# Altium schematic sheet ESP32 with USBC.SchDoc
size A2; SheetNumber: 1; SheetTotal: 1
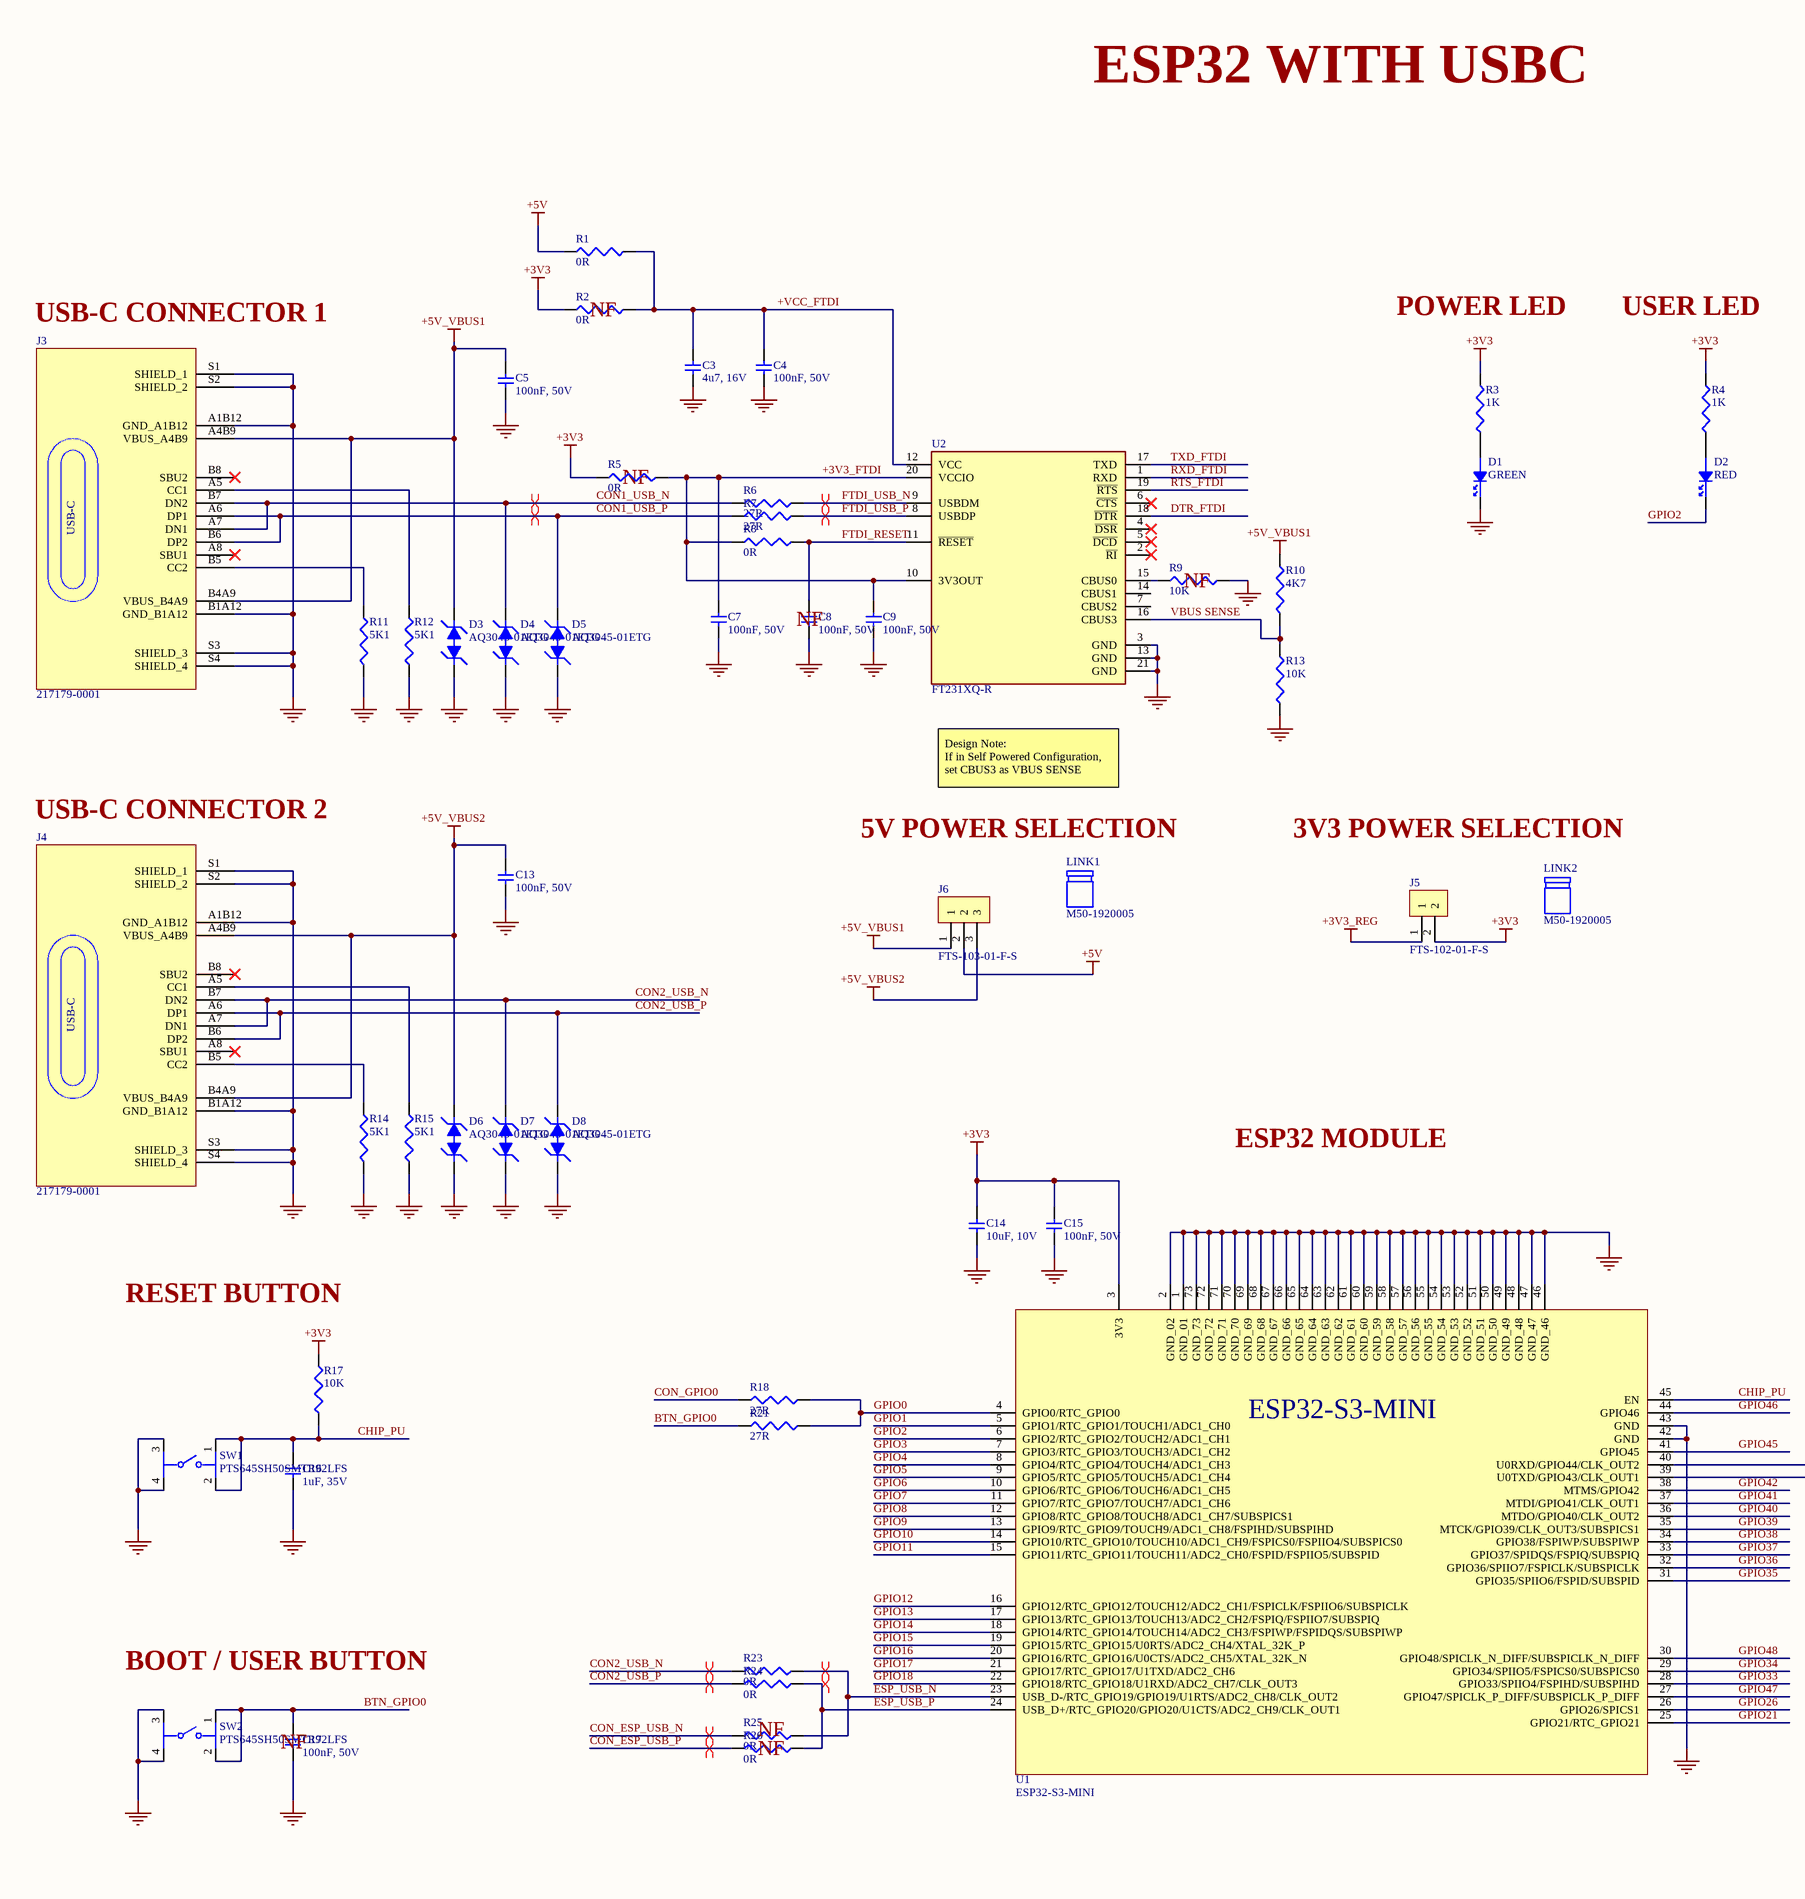
[diagram p0: ESP32 with USBC.SchDoc, left]
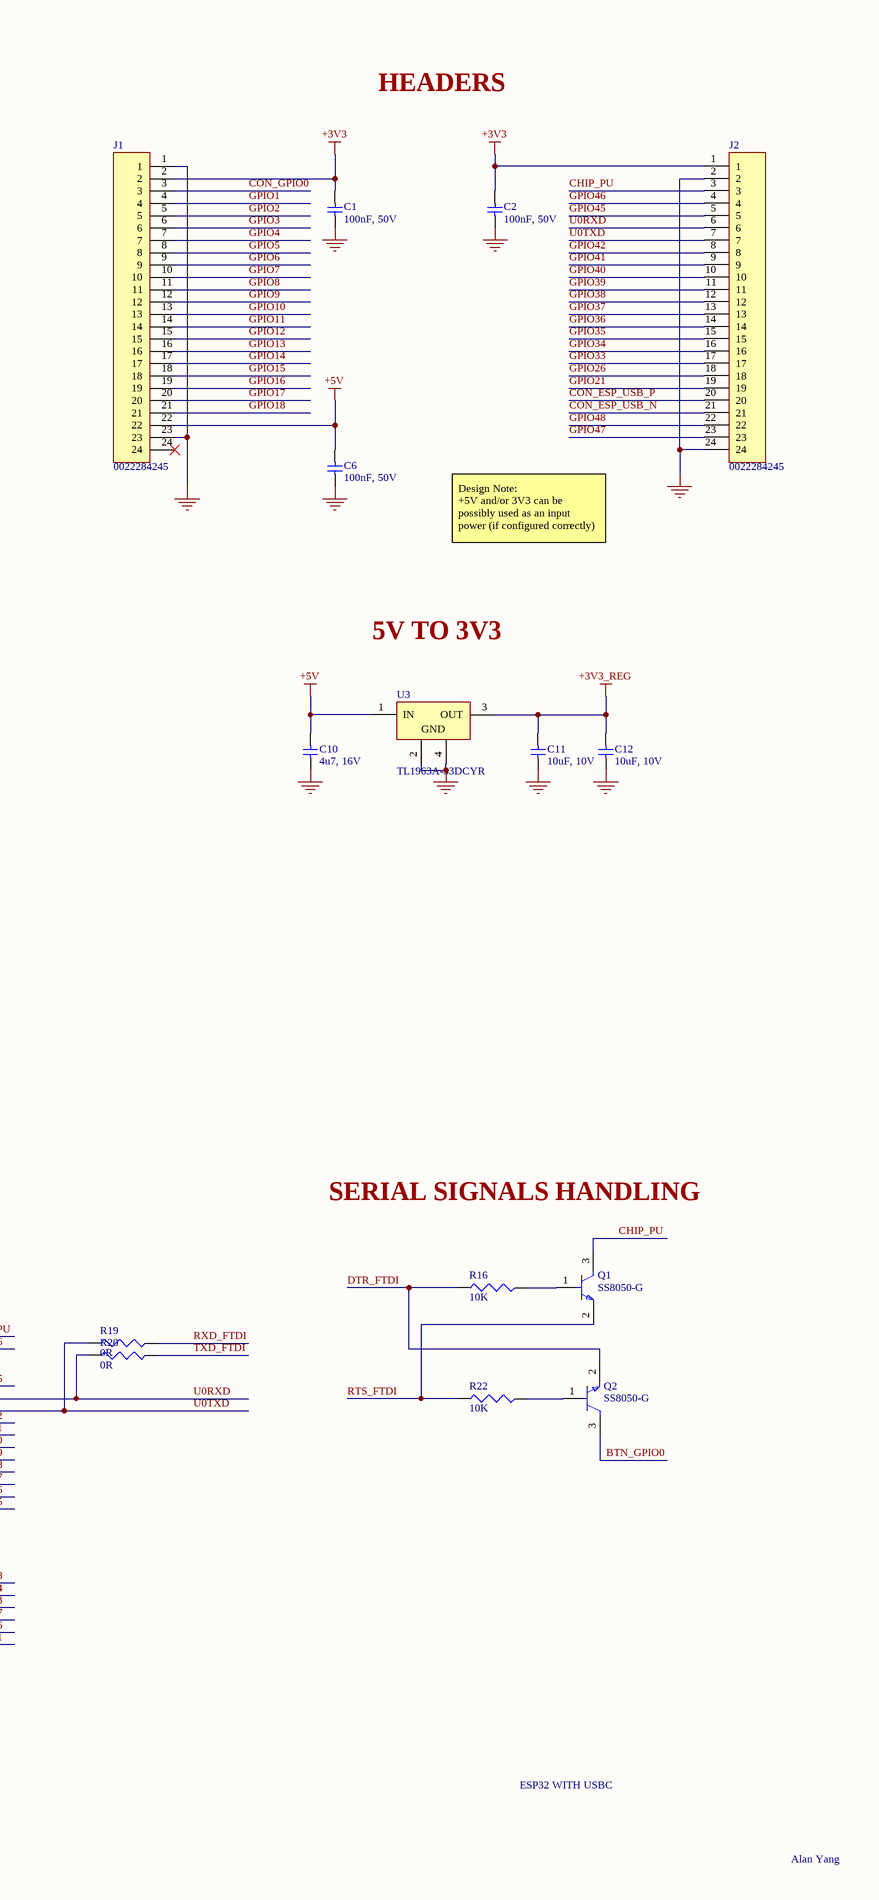
[diagram p1: ESP32 with USBC.SchDoc, right]

## Parts
C1  100nF, 50V  [CAPC1005X55N]
C2  100nF, 50V  [CAPC1005X55N]
C3  4u7, 16V  [CAPC1005X55N]
C4  100nF, 50V  [CAPC1005X55N]
C5  100nF, 50V  [CAPC1005X55N]
C6  100nF, 50V  [CAPC1005X55N]
C7  100nF, 50V  [CAPC1005X55N]
C8  100nF, 50V  [CAPC1005X55N]
C9  100nF, 50V  [CAPC1005X55N]
C10  4u7, 16V  [CAPC1005X55N]
C11  10uF, 10V  [CAPC1005X55N]
C12  10uF, 10V  [CAPC1005X55N]
C13  100nF, 50V  [CAPC1005X55N]
C14  10uF, 10V  [CAPC1005X55N]
C15  100nF, 50V  [CAPC1005X55N]
C16  1uF, 35V  [CAPC1005X55N]
C17  100nF, 50V  [CAPC1005X55N]
D1  GREEN  [LED0402G]
D2  RED  [LED0402R]
D3  AQ3045-01ETG  [SOD882]
D4  AQ3045-01ETG  [SOD882]
D5  AQ3045-01ETG  [SOD882]
D6  AQ3045-01ETG  [SOD882]
D7  AQ3045-01ETG  [SOD882]
D8  AQ3045-01ETG  [SOD882]
J1  0022284245  [HDR_1X24_2.54MM]
J2  0022284245  [HDR_1X24_2.54MM]
J3  217179-0001  [FP-2171790001-MFG]
J4  217179-0001  [FP-2171790001-MFG]
J5  FTS-102-01-F-S  [HDR_1X2_1.27MM]
J6  FTS-103-01-F-S  [HDR_1X3_1.27MM]
LINK1  M50-1920005  (mechanical)
LINK2  M50-1920005  (mechanical)
Q1  SS8050-G  [FP-SS8050-G-IPC_B]
Q2  SS8050-G  [FP-SS8050-G-IPC_B]
R1  0R  [RESC1005X37N]
R2  0R  [RESC1005X37N]
R3  1K  [RESC1005X37N]
R4  1K  [RESC1005X37N]
R5  0R  [RESC1005X37N]
R6  27R  [RESC1005X37N]
R7  27R  [RESC1005X37N]
R8  0R  [RESC1005X37N]
R9  10K  [RESC1005X37N]
R10  4K7  [RESC1005X37N]
R11  5K1  [RESC1005X37N]
R12  5K1  [RESC1005X37N]
R13  10K  [RESC1005X37N]
R14  5K1  [RESC1005X37N]
R15  5K1  [RESC1005X37N]
R16  10K  [RESC1005X37N]
R17  10K  [RESC1005X37N]
R18  27R  [RESC1005X37N]
R19  0R  [RESC1005X37N]
R20  0R  [RESC1005X37N]
R21  27R  [RESC1005X37N]
R22  10K  [RESC1005X37N]
R23  0R  [RESC1005X37N]
R24  0R  [RESC1005X37N]
R25  0R  [RESC1005X37N]
R26  0R  [RESC1005X37N]
SW1  PTS645SH50SMTR92LFS  [FP-PTS645SH50SMTR92LFS-MFG]
SW2  PTS645SH50SMTR92LFS  [FP-PTS645SH50SMTR92LFS-MFG]
U1  ESP32-S3-MINI  [XCVR_ESP32-S3-MINI-1-N8]
U2  FT231XQ-R  [FP-QFN-20-IPC_B]
U3  TL1963A-33DCYR  [DCY0004A_N]

## Nets
+3V3: C1.2 C2.2 C14.2 C15.2 J1.2 J2.1 J5.2 R2.1 R3.2 R4.2 R5.1 R17.2 U1.3(3V3)
+3V3_REG: C11.2 C12.2 J5.1 U3.3(OUT)
+5V: C6.2 C10.2 J1.22 J6.2 R1.1 U3.1(IN)
+5V_VBUS1: C5.2 D3.2 J3.A4B9(VBUS_A4B9) J3.B4A9(VBUS_B4A9) J6.1 R10.2
+5V_VBUS2: C13.2 D6.2 J4.A4B9(VBUS_A4B9) J4.B4A9(VBUS_B4A9) J6.3
GND: C1.1 C2.1 C3.2 C4.1 C5.1 C6.1 C7.1 C8.1 C9.1 C10.1 C11.1 C12.1 C13.1 C14.1 C15.1 C16.1 C17.1 D1.1 D3.1 D4.1 D5.1 D6.1 D7.1 D8.1 J1.1 J1.23 J2.2 J2.24 J3.A1B12(GND_A1B12) J3.B1A12(GND_B1A12) J3.S1(SHIELD_1) J3.S2(SHIELD_2) J3.S3(SHIELD_3) J3.S4(SHIELD_4) J4.A1B12(GND_A1B12) J4.B1A12(GND_B1A12) J4.S1(SHIELD_1) J4.S2(SHIELD_2) J4.S3(SHIELD_3) J4.S4(SHIELD_4) R9.2 R11.1 R12.1 R13.1 R14.1 R15.1 SW1.3 SW1.4 SW2.3 SW2.4 U1.1(GND_01) U1.2(GND_02) U1.42(GND) U1.43(GND) U1.46(GND_46) U1.47(GND_47) U1.48(GND_48) U1.49(GND_49) U1.50(GND_50) U1.51(GND_51) U1.52(GND_52) U1.53(GND_53) U1.54(GND_54) U1.55(GND_55) U1.56(GND_56) U1.57(GND_57) U1.58(GND_58) U1.59(GND_59) U1.60(GND_60) U1.61(GND_61) U1.62(GND_62) U1.63(GND_63) U1.64(GND_64) U1.65(GND_65) U1.66(GND_66) U1.67(GND_67) U1.68(GND_68) U1.69(GND_69) U1.70(GND_70) U1.71(GND_71) U1.72(GND_72) U1.73(GND_73) U2.3(GND) U2.13(GND) U2.21(GND) U3.2(GND) U3.4(GND)
+3V3_FTDI: C7.2 C9.2 R5.2 R8.1 U2.10(3V3OUT) U2.20(VCCIO)
+VCC_FTDI: C3.1 C4.2 R1.2 R2.2 U2.12(VCC)
BTN_GPIO0: C17.2 Q2.3(C) R21.1 SW2.1 SW2.2
CHIP_PU: C16.2 J2.3 Q1.3(C) R17.1 SW1.1 SW1.2 U1.45(EN)
CON1_USB_N: D4.2 J3.A7(DN1) J3.B7(DN2) R6.1
CON1_USB_P: D5.2 J3.A6(DP1) J3.B6(DP2) R7.1
CON2_USB_N: D7.2 J4.A7(DN1) J4.B7(DN2) R23.1
CON2_USB_P: D8.2 J4.A6(DP1) J4.B6(DP2) R24.1
CON_ESP_USB_N: J2.21 R25.1
CON_ESP_USB_P: J2.20 R26.1
CON_GPIO0: J1.3 R18.1
DTR_FTDI: Q2.2(E) R16.1 U2.18(~{DTR})
ESP_USB_N: R23.2 R25.2 U1.23(USB_D-/RTC_GPIO19/GPIO19/U1RTS/ADC2_CH8/CLK_OUT2)
ESP_USB_P: R24.2 R26.2 U1.24(USB_D+/RTC_GPIO20/GPIO20/U1CTS/ADC2_CH9/CLK_OUT1)
FTDI_RESET: C8.2 R8.2 U2.11(~{RESET})
FTDI_USB_N: R6.2 U2.9(USBDM)
FTDI_USB_P: R7.2 U2.8(USBDP)
GPIO0: R18.2 R21.2 U1.4(GPIO0/RTC_GPIO0)
GPIO1: J1.4 U1.5(GPIO1/RTC_GPIO1/TOUCH1/ADC1_CH0)
GPIO2: D2.1 J1.5 U1.6(GPIO2/RTC_GPIO2/TOUCH2/ADC1_CH1)
GPIO3: J1.6 U1.7(GPIO3/RTC_GPIO3/TOUCH3/ADC1_CH2)
GPIO4: J1.7 U1.8(GPIO4/RTC_GPIO4/TOUCH4/ADC1_CH3)
GPIO5: J1.8 U1.9(GPIO5/RTC_GPIO5/TOUCH5/ADC1_CH4)
GPIO6: J1.9 U1.10(GPIO6/RTC_GPIO6/TOUCH6/ADC1_CH5)
GPIO7: J1.10 U1.11(GPIO7/RTC_GPIO7/TOUCH7/ADC1_CH6)
GPIO8: J1.11 U1.12(GPIO8/RTC_GPIO8/TOUCH8/ADC1_CH7/SUBSPICS1)
GPIO9: J1.12 U1.13(GPIO9/RTC_GPIO9/TOUCH9/ADC1_CH8/FSPIHD/SUBSPIHD)
GPIO10: J1.13 U1.14(GPIO10/RTC_GPIO10/TOUCH10/ADC1_CH9/FSPICS0/FSPIIO4/SUBSPICS0)
GPIO11: J1.14 U1.15(GPIO11/RTC_GPIO11/TOUCH11/ADC2_CH0/FSPID/FSPIIO5/SUBSPID)
GPIO12: J1.15 U1.16(GPIO12/RTC_GPIO12/TOUCH12/ADC2_CH1/FSPICLK/FSPIIO6/SUBSPICLK)
GPIO13: J1.16 U1.17(GPIO13/RTC_GPIO13/TOUCH13/ADC2_CH2/FSPIQ/FSPIIO7/SUBSPIQ)
GPIO14: J1.17 U1.18(GPIO14/RTC_GPIO14/TOUCH14/ADC2_CH3/FSPIWP/FSPIDQS/SUBSPIWP)
GPIO15: J1.18 U1.19(GPIO15/RTC_GPIO15/U0RTS/ADC2_CH4/XTAL_32K_P)
GPIO16: J1.19 U1.20(GPIO16/RTC_GPIO16/U0CTS/ADC2_CH5/XTAL_32K_N)
GPIO17: J1.20 U1.21(GPIO17/RTC_GPIO17/U1TXD/ADC2_CH6)
GPIO18: J1.21 U1.22(GPIO18/RTC_GPIO18/U1RXD/ADC2_CH7/CLK_OUT3)
GPIO21: J2.19 U1.25(GPIO21/RTC_GPIO21)
GPIO26: J2.18 U1.26(GPIO26/SPICS1)
GPIO33: J2.17 U1.28(GPIO33/SPIIO4/FSPIHD/SUBSPIHD)
GPIO34: J2.16 U1.29(GPIO34/SPIIO5/FSPICS0/SUBSPICS0)
GPIO35: J2.15 U1.31(GPIO35/SPIIO6/FSPID/SUBSPID)
GPIO36: J2.14 U1.32(GPIO36/SPIIO7/FSPICLK/SUBSPICLK)
GPIO37: J2.13 U1.33(GPIO37/SPIDQS/FSPIQ/SUBSPIQ)
GPIO38: J2.12 U1.34(GPIO38/FSPIWP/SUBSPIWP)
GPIO39: J2.11 U1.35(MTCK/GPIO39/CLK_OUT3/SUBSPICS1)
GPIO40: J2.10 U1.36(MTDO/GPIO40/CLK_OUT2)
GPIO41: J2.9 U1.37(MTDI/GPIO41/CLK_OUT1)
GPIO42: J2.8 U1.38(MTMS/GPIO42)
GPIO45: J2.5 U1.41(GPIO45)
GPIO46: J2.4 U1.44(GPIO46)
GPIO47: J2.23 U1.27(GPIO47/SPICLK_P_DIFF/SUBSPICLK_P_DIFF)
GPIO48: J2.22 U1.30(GPIO48/SPICLK_N_DIFF/SUBSPICLK_N_DIFF)
RTS_FTDI: Q1.2(E) R22.1 U2.19(~{RTS})
RXD_FTDI: R19.2 U2.1(RXD)
TXD_FTDI: R20.2 U2.17(TXD)
U0RXD: J2.6 R20.1 U1.40(U0RXD/GPIO44/CLK_OUT2)
U0TXD: J2.7 R19.1 U1.39(U0TXD/GPIO43/CLK_OUT1)
VBUS SENSE: R10.1 R13.2 U2.16(CBUS3)
NetD1_2: D1.2 R3.1
NetD2_2: D2.2 R4.1
NetJ3_A5: J3.A5(CC1) R12.2
NetJ3_B5: J3.B5(CC2) R11.2
NetJ4_A5: J4.A5(CC1) R15.2
NetJ4_B5: J4.B5(CC2) R14.2
NetQ1_1: Q1.1(B) R16.2
NetQ2_1: Q2.1(B) R22.2
NetR9_1: R9.1 U2.15(CBUS0)

Not connected (* = marked no-connect by the designer): J1 24*; J3 A8(SBU1)* B8(SBU2)*; J4 A8(SBU1)* B8(SBU2)*; U2 2(~{RI})* 4(~{DSR})* 5(~{DCD})* 6(~{CTS})* 7(CBUS2) 14(CBUS1)

## Layout directives
differential pair; differential pair class DIFF90: CON1_USB_N, CON1_USB_P, CON2_USB_N, CON2_USB_P, CON_ESP_USB_N, CON_ESP_USB_P, ESP_USB_N, ESP_USB_P, FTDI_USB_N, FTDI_USB_P

## Notes on the sheet
- ESP32 WITH USBC
- HEADERS
- (near J3) USB-C CONNECTOR 1
- (near R2) NF
- POWER LED
- USER LED
- (near R5) NF
- (near R9) NF
- Design Note:
  +5V and/or 3V3 can be possibly used as an input power (if configured correctly)
- (near C8) NF
- 5V TO 3V3
- Design Note:
  If in Self Powered Configuration, set CBUS3 as VBUS SENSE
- (near J4) USB-C CONNECTOR 2
- (near LINK1) 5V POWER SELECTION
- (near LINK2) 3V3 POWER SELECTION
- ESP32 MODULE
- RESET BUTTON
- SERIAL SIGNALS HANDLING
- BOOT / USER BUTTON
- (near C17) NF
- (near R25) NF
- NF
- Alan Yang
- (in symbol 217179-0001) USB-C

## Library data of the parts
C1 C2 C4-C9 C13 C15 C17 = CL05B104KB54PNC: CAP CER 0.1UF 50V X7R 0402; Manufacturer: Samsung; Dielectric Material: Ceramic; Supplier: Avnet; Supplier Part Number: CL05B104KB54PNC; Manufacturer Part Number: CL05B104KB54PNC; RoHS: Yes; Category: Ceramic Capacitors; Pricing: 10000=0.00647, 20000=0.00644, 40000=0.0064, 60000=0.00637, 80000=0.00634 (USD); Pins: 2; Capacitor Type: Ceramic; RoHS Compliant: Yes; Reach SVHC Compliant: Yes; ComponentLink1URL: https://datasheet.ciiva.com:443/pdfs/VipMasterIC/IC/SEMS/SEMS-S-A0006318249/SEMS-S-A0006320959-1.pdf?src-supplier=IHS+Markit; ComponentLink1Description: https://datasheet.ciiva.com:443/pdfs/VipMasterIC/IC/SEMS/SEMS-S-A0006318249/SEMS-S-A0006320959-1.pdf?src-supplier=IHS+Markit; ComponentLink2URL: https://datasheet.octopart.com/CL05B104KB54PNC-Samsung-datasheet-8326407.pdf?src-supplier=TME; ComponentLink2Description: https://datasheet.octopart.com/CL05B104KB54PNC-Samsung-datasheet-8326407.pdf?src-supplier=TME; LCSC Part Number: C307331
C3 C10 = CL05A475MO5NUNC: CAP CER 4.7UF 16V X5R 0402; Manufacturer: Samsung; Dielectric Material: Ceramic; Multilayer: Yes; Tolerance  (fill in as +-): 20%; Supplier: Digikey; Supplier Part Number: 1276-6836-1-ND; Manufacturer Part Number: CL05A475MO5NUNC; RoHS: Yes; Category: Ceramic Capacitors; Stock: 185202; Pricing: 1=0.2, 10=0.126, 100=0.0864, 1000=0.06956 (USD); Mounting Technology: Surface Mount; Pins: 2; Package Shape: Rectangular; Case/Package: 0402; Terminal Finish: Nickel; Min Operating Temperature: -55°C; Max Operating Temperature: 85°C; JESD-609 Code: e3; Value: 4.7uF; Capacitor Type: Ceramic; Package Style: SMTMeter; Packaging: Tape and Reel; Tolerance (fill in as +-): 20%; Rated DC Voltage (URdc): 16V; Temperature Characteristics Code: X5R; Termination: Wraparound; Length: 1mm; Width: 0.5mm; Height: 0.7mm; Reach SVHC Compliant: Yes; RoHS Compliant: Yes; ComponentLink1URL: https://datasheet.ciiva.com:443/pdfs/VipMasterIC/IC/SEMS/SEMS-S-A0008384515/SEMS-S-A0008898881-1.pdf?src-supplier=IHS+Markit; ComponentLink1Description: https://datasheet.ciiva.com:443/pdfs/VipMasterIC/IC/SEMS/SEMS-S-A0008384515/SEMS-S-A0008898881-1.pdf?src-supplier=IHS+Markit; ComponentLink2URL: http://www.farnell.com/datasheets/2710653.pdf?src-supplier=Farnell; ComponentLink2Description: http://www.farnell.com/datasheets/2710653.pdf?src-supplier=Farnell; ComponentLink3URL: http://www.samsungsem.com/kr/support/product-search/mlcc/CL05A475MO5NUNC.jsp?src-supplier=Digikey; ComponentLink3Description: http://www.samsungsem.com/kr/support/product-search/mlcc/CL05A475MO5NUNC.jsp?src-supplier=Digikey; ComponentLink4URL: http://www.farnell.com/datasheets/2710653.pdf?src-supplier=Newark; ComponentLink4Description: http://www.farnell.com/datasheets/2710653.pdf?src-supplier=Newark; ComponentLink5URL: http://www.farnell.com/datasheets/2710653.pdf?src-supplier=Element14; ComponentLink5Description: http://www.farnell.com/datasheets/2710653.pdf?src-supplier=Element14; ComponentLink6URL: https://datasheet.octopart.com/CL05A475MO5NUNC-Samsung-Electro-Mechanics-datasheet-123102911.pdf?src-supplier=Future+Electronics; ComponentLink6Description: https://datasheet.octopart.com/CL05A475MO5NUNC-Samsung-Electro-Mechanics-datasheet-123102911.pdf?src-supplier=Future+Electronics; LCSC Part Number: C318563
C11 C12 C14 = CL05A106MP8NUB8: CAP CER 10UF 10V X5R 0402; Manufacturer: Samsung; Dielectric Material: Ceramic; Multilayer: Yes; Tolerance  (fill in as +-): 20%; Supplier: Digikey; Supplier Part Number: 1276-6830-1-ND; Manufacturer Part Number: CL05A106MP8NUB8; RoHS: Yes; Category: Ceramic Capacitors; Stock: 145429; Pricing: 1=0.2, 10=0.12, 100=0.0808, 1000=0.0568 (USD); Mounting Technology: Surface Mount; Pins: 2; Package Shape: Rectangular; Case/Package: 0402; Terminal Finish: Nickel; Min Operating Temperature: -55°C; Max Operating Temperature: 85°C; JESD-609 Code: e3; Value: 10uF; Capacitor Type: Ceramic; Packaging: Tape and Reel; Tolerance (fill in as +-): 20%; Rated DC Voltage (URdc): 10V; Temperature Characteristics Code: X5R; Termination: Wraparound; Reach SVHC Compliant: Yes; RoHS Compliant: Yes; ComponentLink1URL: https://datasheet.ciiva.com:443/pdfs/VipMasterIC/IC/SEMS/SEMS-S-A0008521219/SEMS-S-A0008521325-1.pdf?src-supplier=IHS+Markit; ComponentLink1Description: https://datasheet.ciiva.com:443/pdfs/VipMasterIC/IC/SEMS/SEMS-S-A0008521219/SEMS-S-A0008521325-1.pdf?src-supplier=IHS+Markit; ComponentLink2URL: http://www.samsungsem.com/kr/support/product-search/mlcc/CL05A106MP8NUB8.jsp?src-supplier=Digikey; ComponentLink2Description: http://www.samsungsem.com/kr/support/product-search/mlcc/CL05A106MP8NUB8.jsp?src-supplier=Digikey; ComponentLink3URL: https://datasheet.octopart.com/CL05A106MP8NUB8-Samsung-Electro-Mechanics-datasheet-136460857.pdf?src-supplier=Future+Electronics; ComponentLink3Description: https://datasheet.octopart.com/CL05A106MP8NUB8-Samsung-Electro-Mechanics-datasheet-136460857.pdf?src-supplier=Future+Electronics; LCSC Part Number: C307415
C16 = CL05A105KL5NRNC: CAP CER 1UF 35V X5R 0402; Manufacturer: Samsung; Dielectric Material: Ceramic; Multilayer: Yes; Tolerance  (fill in as +-): 10%; Supplier: Digikey; Supplier Part Number: 1276-6796-1-ND; Manufacturer Part Number: CL05A105KL5NRNC; RoHS: Yes; Category: Ceramic Capacitors; Stock: 168952; Pricing: 1=0.29, 10=0.17, 100=0.1097, 1000=0.07829, 2500=0.06853, 5000=0.06578 (USD); Mounting Technology: Surface Mount; Pins: 2; Package Shape: Rectangular; Case/Package: 0402; Terminal Finish: Nickel; Min Operating Temperature: -55°C; Max Operating Temperature: 85°C; JESD-609 Code: e3; Value: 1uF; Capacitor Type: Ceramic; Packaging: Tape and Reel; Tolerance (fill in as +-): 10%; Rated DC Voltage (URdc): 35V; Temperature Characteristics Code: X5R; Termination: Wraparound; Reach SVHC Compliant: Yes; RoHS Compliant: Yes; ComponentLink1URL: https://datasheet.ciiva.com:443/pdfs/VipMasterIC/IC/SEMS/SEMS-S-A0008384515/SEMS-S-A0008872905-1.pdf?src-supplier=IHS+Markit; ComponentLink1Description: https://datasheet.ciiva.com:443/pdfs/VipMasterIC/IC/SEMS/SEMS-S-A0008384515/SEMS-S-A0008872905-1.pdf?src-supplier=IHS+Markit; ComponentLink2URL: http://www.samsungsem.com/kr/support/product-search/mlcc/CL05A105KL5NRNC.jsp?src-supplier=Digikey; ComponentLink2Description: http://www.samsungsem.com/kr/support/product-search/mlcc/CL05A105KL5NRNC.jsp?src-supplier=Digikey; ComponentLink3URL: https://datasheet.octopart.com/CL05A105KL5NRNC-Samsung-datasheet-8326407.pdf?src-supplier=TME; ComponentLink3Description: https://datasheet.octopart.com/CL05A105KL5NRNC-Samsung-datasheet-8326407.pdf?src-supplier=TME; LCSC Part Number: C307413
D1 = VLMG1500-GS08: LED YLW-GRN 0402 SMD; Manufacturer: Vishay; Color: Green,Yellow; Shape: Rectangular; Forward Current: 30mA; Forward Voltage: 2.4V; Luminous Intensity-Nom: 90mcd; Channels: 1; Optoelectronic Device Type: SINGLE COLOR LED; Reverse Voltage-Max: 5V; Viewing Angle: 130°; Overall Height: 0.35mm; Supplier: Digikey; Supplier Part Number: VLMG1500-GS08CT-ND; Manufacturer Part Number: VLMG1500-GS08; RoHS: Yes; Category: LEDs; Stock: 119926; Pricing: 1=0.24, 10=0.164, 100=0.1147, 500=0.09218, 1000=0.0847 (USD); Mounting Technology: Surface Mount; Pins: 2; Color@wavelength: Green; Min Operating Temperature: -30°C; Max Operating Temperature: 85°C; Packaging: Tape and Reel; Size: 0.5mm; Terminal Pitch: 0.95mm; Reach SVHC Compliant: Yes; RoHS Compliant: Yes; ComponentLink1URL: https://datasheet.ciiva.com:443/pdfs/VipMasterIC/IC/VISH/VISH-S-A0003457490/VISH-S-A0003457490-1.pdf?src-supplier=IHS+Markit; ComponentLink1Description: https://datasheet.ciiva.com:443/pdfs/VipMasterIC/IC/VISH/VISH-S-A0003457490/VISH-S-A0003457490-1.pdf?src-supplier=IHS+Markit; ComponentLink2URL: https://datasheet.ciiva.com/12071/vlmo1500-244705-12071911.pdf?src-supplier=Mouser; ComponentLink2Description: https://datasheet.ciiva.com/12071/vlmo1500-244705-12071911.pdf?src-supplier=Mouser; ComponentLink3URL: https://datasheet.ciiva.com/13945/vlmo1500-13945360.pdf?src-supplier=Digikey; ComponentLink3Description: https://datasheet.ciiva.com/13945/vlmo1500-13945360.pdf?src-supplier=Digikey; ComponentLink4URL: https://datasheet.ciiva.com/30005/vlmo1500-30005134.pdf?src-supplier=Avnet; ComponentLink4Description: https://datasheet.ciiva.com/30005/vlmo1500-30005134.pdf?src-supplier=Avnet; ComponentLink5URL: https://datasheet.ciiva.com/13945/vlmo1500-13945358.pdf?src-supplier=Digikey; ComponentLink5Description: https://datasheet.ciiva.com/13945/vlmo1500-13945358.pdf?src-supplier=Digikey; ComponentLink6URL: https://datasheet.ciiva.com/13945/vlmo1500-13945359.pdf?src-supplier=Digikey; ComponentLink6Description: https://datasheet.ciiva.com/13945/vlmo1500-13945359.pdf?src-supplier=Digikey; LCSC Part Number: C511404
D2 = VLMS1500-GS08: LED RED 0402 SMD; Manufacturer: Vishay; Shape: Rectangular; Forward Current: 30mA; Forward Voltage: 2.4V; Luminous Intensity-Nom: 54mcd; Channels: 1; Optoelectronic Device Type: SINGLE COLOR LED; Reverse Voltage-Max: 5V; Viewing Angle: 130°; Overall Height: 0.35mm; Supplier: Digikey; Supplier Part Number: VLMS1500-GS08CT-ND; Manufacturer Part Number: VLMS1500-GS08; RoHS: Yes; Category: LEDs; Stock: 90755; Pricing: 1=0.24, 10=0.164, 100=0.1147, 500=0.09218, 1000=0.0847 (USD); Mounting Technology: Surface Mount; Pins: 2; Color: Red; Color@wavelength: Red; Min Operating Temperature: -30°C; Max Operating Temperature: 85°C; Packaging: Tape and Reel; Size: 0.5mm; Terminal Pitch: 0.95mm; Reach SVHC Compliant: Yes; RoHS Compliant: Yes; ComponentLink1URL: https://datasheet.ciiva.com:443/pdfs/VipMasterIC/IC/VISH/VISH-S-A0003457490/VISH-S-A0003457490-1.pdf?src-supplier=IHS+Markit; ComponentLink1Description: https://datasheet.ciiva.com:443/pdfs/VipMasterIC/IC/VISH/VISH-S-A0003457490/VISH-S-A0003457490-1.pdf?src-supplier=IHS+Markit; ComponentLink2URL: https://datasheet.ciiva.com/13945/vlmo1500-13945367.pdf?src-supplier=Digikey; ComponentLink2Description: https://datasheet.ciiva.com/13945/vlmo1500-13945367.pdf?src-supplier=Digikey; ComponentLink3URL: https://datasheet.ciiva.com/13945/vlmo1500-13945368.pdf?src-supplier=Digikey; ComponentLink3Description: https://datasheet.ciiva.com/13945/vlmo1500-13945368.pdf?src-supplier=Digikey; ComponentLink4URL: https://datasheet.ciiva.com/13945/vlmo1500-13945369.pdf?src-supplier=Digikey; ComponentLink4Description: https://datasheet.ciiva.com/13945/vlmo1500-13945369.pdf?src-supplier=Digikey; LCSC Part Number: C511370
D3-D8 = AQ3045-01ETG: TVS DIODE 5.3VWM 12VC SOD882; Manufacturer: Littelfuse; Diode Element Material: SILICON; Package Body Material: Plastic; Polarity: Bidirectional; Max Breakdown Voltage: 9V; Min Breakdown Voltage: 6.8V; Diode Type: TRANS VOLTAGE SUPPRESSOR; Non-rep Peak Rev Power Dis-Max: 40W; Number of Elements: 1; Rep Pk Reverse Voltage-Max: 5.3V; Reference Standard: AEC-Q101; Supplier: Digikey; Supplier Part Number: F9321CT-ND; Manufacturer Part Number: AQ3045-01ETG; RoHS: Yes; Category: TVS Diodes; Stock: 97; Pricing: 1=0.46, 10=0.302, 100=0.141, 500=0.134, 1000=0.127, 2000=0.1255, 5000=0.124 (USD); Pins: 2; Package Shape: Rectangular; Min Operating Temperature: -55°C; Max Operating Temperature: 150°C; Package Style: CHIP CARRIERMeter; Surface Mount: Yes; Technology: AVALANCHE; Terminal Form: No Lead; Terminal Position: BOTTOM; Reach SVHC Compliant: Yes; RoHS Compliant: Yes; ComponentLink1URL: https://datasheet.ciiva.com:443/pdfs/VipMasterIC/IC/LFSI/LFSI-S-A0007892042/LFSI-S-A0007892042-1.pdf?src-supplier=IHS+Markit; ComponentLink1Description: https://datasheet.ciiva.com:443/pdfs/VipMasterIC/IC/LFSI/LFSI-S-A0007892042/LFSI-S-A0007892042-1.pdf?src-supplier=IHS+Markit; ComponentLink2URL: http://www.littelfuse.com/~/media/electronics/datasheets/tvs_diode_arrays/littelfuse_tvs_diode_array_aq3045_datasheet.pdf.pdf?src-supplier=Digikey; ComponentLink2Description: http://www.littelfuse.com/~/media/electronics/datasheets/tvs_diode_arrays/littelfuse_tvs_diode_array_aq3045_datasheet.pdf.pdf?src-supplier=Digikey; ComponentLink3URL: https://www.littelfuse.com/~/media/electronics/datasheets/tvs_diode_arrays/littelfuse_tvs_diode_array_aq3045_datasheet.pdf.pdf?src-supplier=Digikey; ComponentLink3Description: https://www.littelfuse.com/~/media/electronics/datasheets/tvs_diode_arrays/littelfuse_tvs_diode_array_aq3045_datasheet.pdf.pdf?src-supplier=Digikey; ComponentLink4URL: https://datasheet.octopart.com/AQ3045-01ETG-Littelfuse-datasheet-101609968.pdf?src-supplier=Farnell; ComponentLink4Description: https://datasheet.octopart.com/AQ3045-01ETG-Littelfuse-datasheet-101609968.pdf?src-supplier=Farnell; ComponentLink5URL: https://datasheet.octopart.com/AQ3045-01ETG-Littelfuse-datasheet-140480283.pdf?src-supplier=Future+Electronics; ComponentLink5Description: https://datasheet.octopart.com/AQ3045-01ETG-Littelfuse-datasheet-140480283.pdf?src-supplier=Future+Electronics; LCSC Part Number: C3710326
J1 J2 = 0022284245: CONN HEADER VERT 24POS 2.54MM; Manufacturer: Molex; Supplier: Digikey; Supplier Part Number: 900-0022284245-ND; Manufacturer Part Number: 22-28-4245; RoHS: No; Category: Headers and Wire Housings; Stock: 2532; Pricing: 1=1.21, 10=1.024, 100=0.8699, 500=0.77638, 1000=0.73932, 5000=0.65998, 10000=0.62851 (USD); ComponentLink1URL: https://datasheet.ciiva.com/6814/022284363-sd-6814049.pdf?src-supplier=Digikey; ComponentLink1Description: https://datasheet.ciiva.com/6814/022284363-sd-6814049.pdf?src-supplier=Digikey; ComponentLink2URL: https://datasheet.ciiva.com/10075/0022284245-pcb-headers-10075617.pdf?src-supplier=Avnet; ComponentLink2Description: https://datasheet.ciiva.com/10075/0022284245-pcb-headers-10075617.pdf?src-supplier=Avnet; ComponentLink3URL: https://datasheet.ciiva.com/1433/1597854-1433759.pdf?src-supplier=Element14; ComponentLink3Description: https://datasheet.ciiva.com/1433/1597854-1433759.pdf?src-supplier=Element14; LCSC Part Number: C7145888
J3 J4 = 217179-0001: CONN RCP USB2.0 TYP C 24P SMD RA; Manufacturer: Molex; Supplier: Digikey; Supplier Part Number: 900-2171790001CT-ND; Manufacturer Part Number: 217179-0001; RoHS: No; Category: Connectors; Stock: 19217; Pricing: 1=0.83, 10=0.704, 25=0.6596, 50=0.628, 100=0.598, 250=0.56052, 500=0.53374 (USD); LCSC Part Number: C3197684
J5 = FTS-102-01-F-S: CONN HEADER VERT 2POS 1.27MM; Manufacturer: Samtec; Manufacturer Series: FTS; Connector Type: BOARD CONNECTOR; Option: General Purpose; Additional Feature: Low Profile; Filter Feature: No; Number of Rows Loaded: 1; Number of Contacts: 2; Supplier: Digikey; Supplier Part Number: SAM15176-ND; Manufacturer Part Number: FTS-102-01-F-S; RoHS: Yes; Category: Connectors; Stock: 520; Pricing: 1=0.49, 50=0.4252, 100=0.3608, 500=0.2994, 1000=0.25609, 2000=0.20954, 5000=0.19062 (USD); Mounting Technology: Board; Contact Material: Bronze; Contact Finish - Mating: GOLD (3) OVER NICKEL (50); Contact Finish - Termination: Matte Tin (Sn) - with Nickel (Ni) barrier; JESD-609 Code: e3; Contact Gender: Male; Mixed Contacts: No; Mounting Style: STRAIGHT; Termination: Solder; Terminal Pitch: 1.27mm; Flammability Rating: UL94 V-0; DIN Conformance: No; IEC Conformance: No; MIL Conformance: No; Reach SVHC Compliant: Yes; RoHS Compliant: Yes; ComponentLink1URL: https://datasheet.ciiva.com:443/pdfs/VipMasterIC/IC/SAMI/SAMI-S-A0001504673/SAMI-S-A0001504673-1.pdf?src-supplier=IHS+Markit; ComponentLink1Description: https://datasheet.ciiva.com:443/pdfs/VipMasterIC/IC/SAMI/SAMI-S-A0001504673/SAMI-S-A0001504673-1.pdf?src-supplier=IHS+Markit; ComponentLink2URL: http://suddendocs.samtec.com/catalog_english/fts.pdf?src-supplier=Digikey; ComponentLink2Description: http://suddendocs.samtec.com/catalog_english/fts.pdf?src-supplier=Digikey; ComponentLink3URL: http://www.samtec.com/documents/webfiles/pdf/FTS.pdf?src-supplier=Avnet; ComponentLink3Description: http://www.samtec.com/documents/webfiles/pdf/FTS.pdf?src-supplier=Avnet; ComponentLink4URL: https://datasheet.octopart.com/FTS-102-01-F-S-Samtec-datasheet-118493358.pdf?src-supplier=Electro+Sonic; ComponentLink4Description: https://datasheet.octopart.com/FTS-102-01-F-S-Samtec-datasheet-118493358.pdf?src-supplier=Electro+Sonic; ComponentLink5URL: https://datasheet.octopart.com/FTS-102-01-F-S-Samtec-datasheet-151470456.pdf?src-supplier=Sager+Electronics; ComponentLink5Description: https://datasheet.octopart.com/FTS-102-01-F-S-Samtec-datasheet-151470456.pdf?src-supplier=Sager+Electronics; ComponentLink6URL: https://datasheet.octopart.com/FTS-102-01-F-S-Samtec-datasheet-176663378.pdf?src-supplier=Toby+Electronics; ComponentLink6Description: https://datasheet.octopart.com/FTS-102-01-F-S-Samtec-datasheet-176663378.pdf?src-supplier=Toby+Electronics; LCSC Part Number: C6045317
J6 = FTS-103-01-F-S: CONN HEADER VERT 3POS 1.27MM; Manufacturer: Samtec; Manufacturer Series: FTS; Connector Type: BOARD CONNECTOR; Option: General Purpose; Additional Feature: Low Profile; Filter Feature: No; Number of Rows Loaded: 1; Number of Contacts: 3; Supplier: Digikey; Supplier Part Number: 612-FTS-103-01-F-S-ND; Manufacturer Part Number: FTS-103-01-F-S; RoHS: Yes; Category: Connectors; Stock: 1584; Pricing: 1=0.73, 50=0.6378, 100=0.5407, 500=0.4491, 1000=0.38362, 2000=0.31431, 5000=0.2478, 10000=0.228 (USD); Mounting Technology: Board; Contact Material: Bronze; Contact Finish - Mating: GOLD (3) OVER NICKEL (50); Contact Finish - Termination: Matte Tin (Sn) - with Nickel (Ni) barrier; JESD-609 Code: e3; Contact Gender: Male; Mixed Contacts: No; Mounting Style: STRAIGHT; Termination: Solder; Terminal Pitch: 1.27mm; Flammability Rating: UL94 V-0; DIN Conformance: No; IEC Conformance: No; MIL Conformance: No; Reach SVHC Compliant: Yes; RoHS Compliant: Yes; ComponentLink1URL: https://datasheet.ciiva.com:443/pdfs/VipMasterIC/IC/SAMI/SAMI-S-A0001504673/SAMI-S-A0001504673-1.pdf?src-supplier=IHS+Markit; ComponentLink1Description: https://datasheet.ciiva.com:443/pdfs/VipMasterIC/IC/SAMI/SAMI-S-A0001504673/SAMI-S-A0001504673-1.pdf?src-supplier=IHS+Markit; ComponentLink2URL: http://www.samtec.com/documents/webfiles/pdf/FTS.pdf?src-supplier=Avnet; ComponentLink2Description: http://www.samtec.com/documents/webfiles/pdf/FTS.pdf?src-supplier=Avnet; ComponentLink3URL: http://suddendocs.samtec.com/prints/fts-1xx-xx-xx-xx-xx-mkt.pdf?src-supplier=Digikey; ComponentLink3Description: http://suddendocs.samtec.com/prints/fts-1xx-xx-xx-xx-xx-mkt.pdf?src-supplier=Digikey; ComponentLink4URL: https://datasheet.octopart.com/FTS-103-01-F-S-Samtec-datasheet-151470456.pdf?src-supplier=Sager+Electronics; ComponentLink4Description: https://datasheet.octopart.com/FTS-103-01-F-S-Samtec-datasheet-151470456.pdf?src-supplier=Sager+Electronics; ComponentLink5URL: https://datasheet.octopart.com/FTS-103-01-F-S-Samtec-datasheet-176663378.pdf?src-supplier=Toby+Electronics; ComponentLink5Description: https://datasheet.octopart.com/FTS-103-01-F-S-Samtec-datasheet-176663378.pdf?src-supplier=Toby+Electronics; LCSC Part Number: C3333578
LINK1 LINK2 = M50-1920005: CONN SHUNT 1.27MM RED; Manufacturer: Harwin; Manufacturer Series: M50; Connector Type: Interconnection Device; Body/Shell Style: PLUG; Contact Pattern: RECTANGULAR; Contact Resistance: 20mR; Dielectric Withstanding Voltage (AC): 500V; Durability: 300Cycles; Insulation Resistance: 1GR; Number Of Connectors: 1; Rated Current (Signal): 1A; Number of Contacts: 2; Body Breadth: 0.059inch; Body Depth: 0.118inch; Body Length: 0.098inch; Mating Contact Pitch: 0.05inch; Reference Standard: UL; Reliability: COMMERCIAL; Supplier: Digikey; Supplier Part Number: 952-1727-ND; Manufacturer Part Number: M50-1920005; RoHS: Yes; Category: Headers and Wire Housings; Stock: 4945; Pricing: 1=0.33, 10=0.284, 25=0.2664, 50=0.2536, 100=0.2414, 250=0.22628, 500=0.21546, 1000=0.20516, 3000=0.18984 (USD); Contact Material: Copper Alloy; Contact Finish - Mating: AU ON NI; Contact Finish - Termination: Gold (Au); Insulation Color: Red; Insulation Material: Nylon; Min Operating Temperature: -40°C; Max Operating Temperature: 105°C; JESD-609 Code: e4; Contact Gender: Female; Mounting Style: STRAIGHT; Number of Rows Loaded: 1; Reach SVHC Compliant: Yes; RoHS Compliant: Yes; ComponentLink1URL: https://datasheet.ciiva.com:443/pdfs/VipMasterIC/IC/HRWN/HRWNS04645/HRWNS04645-1.pdf?src-supplier=IHS+Markit; ComponentLink1Description: https://datasheet.ciiva.com:443/pdfs/VipMasterIC/IC/HRWN/HRWNS04645/HRWNS04645-1.pdf?src-supplier=IHS+Markit; ComponentLink2URL: https://datasheet.ciiva.com/4573/m50-19x-350826-4573042.pdf?src-supplier=Mouser; ComponentLink2Description: https://datasheet.ciiva.com/4573/m50-19x-350826-4573042.pdf?src-supplier=Mouser; ComponentLink3URL: https://datasheet.ciiva.com/767/m50-19x-767921.pdf?src-supplier=Digikey; ComponentLink3Description: https://datasheet.ciiva.com/767/m50-19x-767921.pdf?src-supplier=Digikey; ComponentLink4URL: https://datasheet.ciiva.com/1456/m50-19x-1456640.pdf?src-supplier=Newark; ComponentLink4Description: https://datasheet.ciiva.com/1456/m50-19x-1456640.pdf?src-supplier=Newark; ComponentLink5URL: https://datasheet.ciiva.com/1412/1836978-1412125.pdf?src-supplier=Element14; ComponentLink5Description: https://datasheet.ciiva.com/1412/1836978-1412125.pdf?src-supplier=Element14; LCSC Part Number: C6985646
Q1 Q2 = SS8050-G: TRANS NPN 25V 1.5A SOT-23-3; Manufacturer: Comchip; Supplier: Digikey; Supplier Part Number: 641-1790-1-ND; Manufacturer Part Number: SS8050-G; RoHS: Yes; Category: Transistors; Stock: 131580; Pricing: 1=0.24, 10=0.148, 100=0.0921, 500=0.06754, 1000=0.05958 (USD); Reach SVHC Compliant: Yes; RoHS Compliant: Yes; ComponentLink1URL: https://datasheet.ciiva.com:443/pdfs/VipMasterIC/IC/COMC/COMC-S-A0004994192/COMC-S-A0004994192-1.pdf?src-supplier=IHS+Markit; ComponentLink1Description: https://datasheet.ciiva.com:443/pdfs/VipMasterIC/IC/COMC/COMC-S-A0004994192/COMC-S-A0004994192-1.pdf?src-supplier=IHS+Markit; ComponentLink2URL: http://www.comchiptech.com/admin/files/product/SS8050-G RevA181526.pdf?src-supplier=Digikey; ComponentLink2Description: http://www.comchiptech.com/admin/files/product/SS8050-G RevA181526.pdf?src-supplier=Digikey; LCSC Part Number: C164886
R1 R2 R5 R8 R19 R20 R23-R26 = RC0402JR-070RL: RES 0 OHM JUMPER 1/16W 0402; Manufacturer: Yageo; Power: 62.5mW; Rated Temperature: 70°C; Package Height: 0.35mm; Package Length: 1mm; Package Width: 0.5mm; Supplier: Digikey; Supplier Part Number: 311-0.0JRCT-ND; Manufacturer Part Number: RC0402JR-070RL; RoHS: Yes; Category: Chip SMD Resistors; Stock: 1917471; Pricing: 1=0.1, 10=0.01, 25=0.0064, 50=0.0054, 100=0.0047, 250=0.00392, 500=0.00346, 1000=0.00304, 5000=0.0023, 10000=0.00206, 20000=0.00185, 30000=0.00175, 50000=0.00163, 70000=0.00155, 100000=0.00148, 250000=0.00133, 500000=0.00123, 1000000=0.00115 (USD); Mounting Technology: Surface Mount; Pins: 2; Package Shape: Rectangular; Case/Package: 0402; Terminal Finish: Nickel; Min Operating Temperature: -55°C; Max Operating Temperature: 155°C; JESD-609 Code: e3; Resistor Type: FIXED RESISTOR; Construction: Chip; Packaging: Tape and Reel; Value: 0R; Technology: METAL GLAZE/THICK FILM; Termination: Wraparound; Reach SVHC Compliant: Yes; RoHS Compliant: Yes; ComponentLink1URL: https://datasheet.ciiva.com:443/pdfs/VipMasterIC/IC/YAGO/YAGO-S-A0008145938/YAGO-S-A0008145938-1.pdf?src-supplier=IHS+Markit; ComponentLink1Description: https://datasheet.ciiva.com:443/pdfs/VipMasterIC/IC/YAGO/YAGO-S-A0008145938/YAGO-S-A0008145938-1.pdf?src-supplier=IHS+Markit; ComponentLink2URL: https://datasheet.ciiva.com/2452/pyu-rc0402-51-rohs-l-6-2452608.pdf?src-supplier=Digikey; ComponentLink2Description: https://datasheet.ciiva.com/2452/pyu-rc0402-51-rohs-l-6-2452608.pdf?src-supplier=Digikey; ComponentLink3URL: https://datasheet.ciiva.com/11808/0900766b80c66297-11808195.pdf?src-supplier=Rs; ComponentLink3Description: https://datasheet.ciiva.com/11808/0900766b80c66297-11808195.pdf?src-supplier=Rs; ComponentLink4URL: https://datasheet.ciiva.com/2452/pyu-r-int-thick-7-2452609.pdf?src-supplier=Digikey; ComponentLink4Description: https://datasheet.ciiva.com/2452/pyu-r-int-thick-7-2452609.pdf?src-supplier=Digikey; ComponentLink5URL: https://datasheet.ciiva.com/2452/pyu-r-int-thick-7-2452610.pdf?src-supplier=Digikey; ComponentLink5Description: https://datasheet.ciiva.com/2452/pyu-r-int-thick-7-2452610.pdf?src-supplier=Digikey; ComponentLink6URL: https://datasheet.ciiva.com/8896/pyu-rc0402-51-rohs-l-6-8896201.pdf?src-supplier=Avnet; ComponentLink6Description: https://datasheet.ciiva.com/8896/pyu-rc0402-51-rohs-l-6-8896201.pdf?src-supplier=Avnet; ComponentLink7URL: https://datasheet.ciiva.com/7983/1018594-7983535.pdf?src-supplier=Element14; ComponentLink7Description: https://datasheet.ciiva.com/7983/1018594-7983535.pdf?src-supplier=Element14; ComponentLink8URL: https://datasheet.ciiva.com/22747/1018594-22747515.pdf?src-supplier=Element14; ComponentLink8Description: https://datasheet.ciiva.com/22747/1018594-22747515.pdf?src-supplier=Element14; LCSC Part Number: C60485
R3 R4 = RC0402FR-071KL: RES 1K OHM 1% 1/16W 0402; Manufacturer: Yageo; Additional Feature: LASER TRIMMABLE; Power: 62.5mW; Rated Temperature: 70°C; Value: 1kR; Working Voltage: 50V; Temperature Coefficient (ppm/Cel): 100; Package Height: 0.35mm; Package Length: 1mm; Package Width: 0.5mm; Supplier: Digikey; Supplier Part Number: 311-1.00KLRCT-ND; Manufacturer Part Number: RC0402FR-071KL; RoHS: Yes; Category: Chip SMD Resistors; Stock: 2208377; Pricing: 1=0.1, 10=0.007, 100=0.0061, 1000=0.0051, 2500=0.00408 (USD); Mounting Technology: Surface Mount; Pins: 2; Package Shape: Rectangular; Case/Package: 0402; Terminal Finish: Nickel; Min Operating Temperature: -55°C; Max Operating Temperature: 155°C; Tolerance: 1%; JESD-609 Code: e3; Resistor Type: FIXED RESISTOR; Construction: Chip; Packaging: Tape and Reel; Technology: METAL GLAZE/THICK FILM; Termination: Wraparound; Reach SVHC Compliant: Yes; RoHS Compliant: Yes; ComponentLink1URL: https://datasheet.ciiva.com:443/pdfs/VipMasterIC/IC/YAGO/YAGO-S-A0008145938/YAGO-S-A0008145938-1.pdf?src-supplier=IHS+Markit; ComponentLink1Description: https://datasheet.ciiva.com:443/pdfs/VipMasterIC/IC/YAGO/YAGO-S-A0008145938/YAGO-S-A0008145938-1.pdf?src-supplier=IHS+Markit; ComponentLink2URL: https://datasheet.ciiva.com/11819/0900766b80c66297-11819477.pdf?src-supplier=Rs; ComponentLink2Description: https://datasheet.ciiva.com/11819/0900766b80c66297-11819477.pdf?src-supplier=Rs; ComponentLink3URL: https://datasheet.ciiva.com/7849/1018594-7849869.pdf?src-supplier=Element14; ComponentLink3Description: https://datasheet.ciiva.com/7849/1018594-7849869.pdf?src-supplier=Element14; ComponentLink4URL: https://datasheet.ciiva.com/7849/1018594-7849871.pdf?src-supplier=Element14; ComponentLink4Description: https://datasheet.ciiva.com/7849/1018594-7849871.pdf?src-supplier=Element14; ComponentLink5URL: https://datasheet.ciiva.com/7983/1018594-7983502.pdf?src-supplier=Element14; ComponentLink5Description: https://datasheet.ciiva.com/7983/1018594-7983502.pdf?src-supplier=Element14; ComponentLink6URL: https://datasheet.ciiva.com/22747/1018594-22747513.pdf?src-supplier=Element14; ComponentLink6Description: https://datasheet.ciiva.com/22747/1018594-22747513.pdf?src-supplier=Element14; ComponentLink7URL: https://datasheet.ciiva.com/17063/pyu-rc0402-51-rohs-l-6-r-17063193.pdf?src-supplier=Future+Electronics; ComponentLink7Description: https://datasheet.ciiva.com/17063/pyu-rc0402-51-rohs-l-6-r-17063193.pdf?src-supplier=Future+Electronics; ComponentLink8URL: https://datasheet.ciiva.com/12666/pyu-rc0402-51-rohs-l-6-r-12666741.pdf?src-supplier=Mouser; ComponentLink8Description: https://datasheet.ciiva.com/12666/pyu-rc0402-51-rohs-l-6-r-12666741.pdf?src-supplier=Mouser; LCSC Part Number: C106235
R6 R7 R18 R21 = RC0402FR-0727R4L: RES 27.4 OHM 1% 1/16W 0402; Manufacturer: Yageo; Additional Feature: LASER TRIMMABLE; Power: 62.5mW; Rated Temperature: 70°C; Value: 27.4R; Working Voltage: 50V; Temperature Coefficient (ppm/Cel): 100; Package Height: 0.35mm; Package Length: 1mm; Package Width: 0.5mm; Supplier: Digikey; Supplier Part Number: YAG3085CT-ND; Manufacturer Part Number: RC0402FR-0727R4L; RoHS: Yes; Category: Chip SMD Resistors; Stock: 502344; Pricing: 1=0.1, 10=0.007, 100=0.0061, 1000=0.00408, 2500=0.00357 (USD); Mounting Technology: Surface Mount; Pins: 2; Package Shape: Rectangular; Case/Package: 0402; Terminal Finish: Nickel; Min Operating Temperature: -55°C; Max Operating Temperature: 155°C; Tolerance: 1%; JESD-609 Code: e3; Resistor Type: FIXED RESISTOR; Construction: Chip; Packaging: Tape and Reel; Technology: METAL GLAZE/THICK FILM; Termination: Wraparound; Reach SVHC Compliant: Yes; RoHS Compliant: Yes; ComponentLink1URL: https://datasheet.ciiva.com:443/pdfs/VipMasterIC/IC/YAGO/YAGO-S-A0008145938/YAGO-S-A0008145938-1.pdf?src-supplier=IHS+Markit; ComponentLink1Description: https://datasheet.ciiva.com:443/pdfs/VipMasterIC/IC/YAGO/YAGO-S-A0008145938/YAGO-S-A0008145938-1.pdf?src-supplier=IHS+Markit; ComponentLink2URL: https://www.verical.com/server-webapp/html/getDatasheet?partID=325120&src-supplier=Verical; ComponentLink2Description: https://www.verical.com/server-webapp/html/getDatasheet?partID=325120&src-supplier=Verical; ComponentLink3URL: https://www.yageo.com/upload/media/product/productsearch/datasheet/rchip/PYu-RC_Group_51_RoHS_L_11.pdf?src-supplier=Digikey; ComponentLink3Description: https://www.yageo.com/upload/media/product/productsearch/datasheet/rchip/PYu-RC_Group_51_RoHS_L_11.pdf?src-supplier=Digikey; ComponentLink4URL: http://www.yageo.com/documents/recent/PYu-RC_Group_51_RoHS_L_10.pdf?src-supplier=Digikey; ComponentLink4Description: http://www.yageo.com/documents/recent/PYu-RC_Group_51_RoHS_L_10.pdf?src-supplier=Digikey; ComponentLink5URL: http://www.yageo.com.tw/exep/pages/download/literatures/PYu-R_INT-thick_7.pdf?src-supplier=Digikey; ComponentLink5Description: http://www.yageo.com.tw/exep/pages/download/literatures/PYu-R_INT-thick_7.pdf?src-supplier=Digikey; ComponentLink6URL: http://www.yageo.com/documents/recent/PYu-RC0402_51_RoHS_L_6_r.pdf?src-supplier=Mouser; ComponentLink6Description: http://www.yageo.com/documents/recent/PYu-RC0402_51_RoHS_L_6_r.pdf?src-supplier=Mouser; ComponentLink7URL: https://datasheet.octopart.com/RC0402FR-0727R4L-Yageo-datasheet-10408619.pdf?src-supplier=Element14; ComponentLink7Description: https://datasheet.octopart.com/RC0402FR-0727R4L-Yageo-datasheet-10408619.pdf?src-supplier=Element14; ComponentLink8URL: https://datasheet.octopart.com/RC0402FR-0727R4L-Yageo-datasheet-164759695.pdf?src-supplier=Future+Electronics; ComponentLink8Description: https://datasheet.octopart.com/RC0402FR-0727R4L-Yageo-datasheet-164759695.pdf?src-supplier=Future+Electronics; LCSC Part Number: C274349
R9 R13 R16 R17 R22 = AC0402FR-0710KL: RES SMD 10K OHM 1% 1/16W 0402; Manufacturer: Yageo; Additional Feature: LASER TRIMMABLE; Power: 62.5mW; Rated Temperature: 70°C; Value: 10kR; Working Voltage: 50V; Temperature Coefficient (ppm/Cel): 100; Package Height: 0.32mm; Package Length: 1mm; Package Width: 0.5mm; Reference Standard: AEC-Q200; Supplier: Digikey; Supplier Part Number: YAG3436CT-ND; Manufacturer Part Number: AC0402FR-0710KL; RoHS: Yes; Category: Chip SMD Resistors; Stock: 268638; Pricing: 1=0.1, 10=0.009, 100=0.0082, 1000=0.00612, 2500=0.0051, 5000=0.00407 (USD); Mounting Technology: Surface Mount; Pins: 2; Package Shape: Rectangular; Case/Package: 0402; Terminal Finish: Nickel; Min Operating Temperature: -55°C; Max Operating Temperature: 155°C; Tolerance: 1%; JESD-609 Code: e3; Resistor Type: FIXED RESISTOR; Construction: Chip; Packaging: Tape and Reel; Technology: METAL GLAZE/THICK FILM; Termination: Wraparound; Reach SVHC Compliant: Yes; RoHS Compliant: Yes; ComponentLink1URL: https://datasheet.ciiva.com:443/pdfs/VipMasterIC/IC/YAGO/YAGO-S-A0003597364/YAGO-S-A0003597364-1.pdf?src-supplier=IHS+Markit; ComponentLink1Description: https://datasheet.ciiva.com:443/pdfs/VipMasterIC/IC/YAGO/YAGO-S-A0003597364/YAGO-S-A0003597364-1.pdf?src-supplier=IHS+Markit; ComponentLink2URL: https://datasheet.ciiva.com/12656/pyu-ac-51-rohs-l-2-12656634.pdf?src-supplier=Mouser; ComponentLink2Description: https://datasheet.ciiva.com/12656/pyu-ac-51-rohs-l-2-12656634.pdf?src-supplier=Mouser; LCSC Part Number: C144807
R10 = RC0402FR-074K7L: RES 4.7K OHM 1% 1/16W 0402; Manufacturer: Yageo; Additional Feature: LASER TRIMMABLE; Power: 62.5mW; Rated Temperature: 70°C; Value: 4.7kR; Working Voltage: 50V; Temperature Coefficient (ppm/Cel): 100; Package Height: 0.35mm; Package Length: 1mm; Package Width: 0.5mm; Supplier: Digikey; Supplier Part Number: 311-4.7KLRCT-ND; Manufacturer Part Number: RC0402FR-074K7L; RoHS: Yes; Category: Chip SMD Resistors; Stock: 207; Pricing: 1=0.1, 10=0.007, 100=0.0061, 1000=0.0051, 2500=0.00408, 5000=0.00312 (USD); Mounting Technology: Surface Mount; Pins: 2; Package Shape: Rectangular; Case/Package: 0402; Terminal Finish: Nickel; Min Operating Temperature: -55°C; Max Operating Temperature: 155°C; Tolerance: 1%; JESD-609 Code: e3; Resistor Type: FIXED RESISTOR; Construction: Chip; Packaging: Tape and Reel; Technology: METAL GLAZE/THICK FILM; Termination: Wraparound; Reach SVHC Compliant: Yes; RoHS Compliant: Yes; ComponentLink1URL: https://datasheet.ciiva.com:443/pdfs/VipMasterIC/IC/YAGO/YAGO-S-A0008145938/YAGO-S-A0008145938-1.pdf?src-supplier=IHS+Markit; ComponentLink1Description: https://datasheet.ciiva.com:443/pdfs/VipMasterIC/IC/YAGO/YAGO-S-A0008145938/YAGO-S-A0008145938-1.pdf?src-supplier=IHS+Markit; ComponentLink2URL: https://datasheet.ciiva.com/22661/1686128-22661342.pdf?src-supplier=Element14; ComponentLink2Description: https://datasheet.ciiva.com/22661/1686128-22661342.pdf?src-supplier=Element14; ComponentLink3URL: https://datasheet.ciiva.com/7850/1018594-7850022.pdf?src-supplier=Element14; ComponentLink3Description: https://datasheet.ciiva.com/7850/1018594-7850022.pdf?src-supplier=Element14; ComponentLink4URL: https://datasheet.ciiva.com/7850/1018594-7850023.pdf?src-supplier=Element14; ComponentLink4Description: https://datasheet.ciiva.com/7850/1018594-7850023.pdf?src-supplier=Element14; LCSC Part Number: C105871
R11 R12 R14 R15 = AC0402FR-075K1L: RES SMD 5.1K OHM 1% 1/16W 0402; Manufacturer: Yageo; Additional Feature: LASER TRIMMABLE; Power: 62.5mW; Rated Temperature: 70°C; Value: 5.1kR; Working Voltage: 50V; Temperature Coefficient (ppm/Cel): 100; Package Height: 0.32mm; Package Length: 1mm; Package Width: 0.5mm; Reference Standard: AEC-Q200; Supplier: Digikey; Supplier Part Number: YAG3503CT-ND; Manufacturer Part Number: AC0402FR-075K1L; RoHS: Yes; Category: Chip SMD Resistors; Stock: 18891; Pricing: 1=0.1, 10=0.009, 100=0.0071, 1000=0.00612, 2500=0.0051, 5000=0.00407 (USD); Mounting Technology: Surface Mount; Pins: 2; Package Shape: Rectangular; Case/Package: 0402; Terminal Finish: Nickel; Min Operating Temperature: -55°C; Max Operating Temperature: 155°C; Tolerance: 1%; JESD-609 Code: e3; Resistor Type: FIXED RESISTOR; Construction: Chip; Packaging: Tape and Reel; Technology: METAL GLAZE/THICK FILM; Termination: Wraparound; Reach SVHC Compliant: Yes; RoHS Compliant: Yes; ComponentLink1URL: https://datasheet.ciiva.com:443/pdfs/VipMasterIC/IC/YAGO/YAGO-S-A0003597364/YAGO-S-A0003597364-1.pdf?src-supplier=IHS+Markit; ComponentLink1Description: https://datasheet.ciiva.com:443/pdfs/VipMasterIC/IC/YAGO/YAGO-S-A0003597364/YAGO-S-A0003597364-1.pdf?src-supplier=IHS+Markit; ComponentLink2URL: http://www.yageo.com/NewPortal/yageodocoutput?fileName=/pdf/R-Chip/PYu-AC_51_RoHS_L_6.pdf&src-supplier=Digikey; ComponentLink2Description: http://www.yageo.com/NewPortal/yageodocoutput?fileName=/pdf/R-Chip/PYu-AC_51_RoHS_L_6.pdf&src-supplier=Digikey; ComponentLink3URL: http://www.yageo.com/documents/recent/PYu-AC_51_RoHS_L_2_revised.pdf?src-supplier=Future+Electronics; ComponentLink3Description: http://www.yageo.com/documents/recent/PYu-AC_51_RoHS_L_2_revised.pdf?src-supplier=Future+Electronics; ComponentLink4URL: https://datasheet.octopart.com/AC0402FR-075K1L-Yageo-datasheet-166720450.pdf?src-supplier=Future+Electronics; ComponentLink4Description: https://datasheet.octopart.com/AC0402FR-075K1L-Yageo-datasheet-166720450.pdf?src-supplier=Future+Electronics; LCSC Part Number: C144745
SW1 SW2 = PTS645SH50SMTR92LFS: SWITCH TACTILE SPST-NO 0.05A 12V; Manufacturer: ITT C&K; Manufacturer Series: PTS645; Actuator Type: Pushbutton; Contact Current(DC)-Max: 50mA; Contact DC Max Rating R Load: 0.05A@12VDC; Contact Resistance: 0.1mR; Dielectric Withstand Volts: 250VACV; Insulation Resistance: 100GR; PCB Hole Count: 4; Switch Action: MOMENTARY; Switch Function: SPST; Switch Type: Keypad; Body Breadth: 5.9944mm; Body Height: 3.4544mm; Supplier: Digikey; Supplier Part Number: CKN9085CT-ND; Manufacturer Part Number: PTS645SH50SMTR92LFS; RoHS: Yes; Category: Tactile Switches; Stock: 14865; Pricing: 1=0.33, 10=0.285, 25=0.2692, 100=0.2476, 250=0.23404, 500=0.22418 (USD); Mounting Technology: Surface Mount; Terminal Finish: Silver; Min Operating Temperature: -20°C; Max Operating Temperature: 60°C; JESD-609 Code: e4; Contact Voltage(DC)-Max: 12V; Termination: Solder; Body Length or Diameter: 5.9944mm; Terminal Length: 0.138inch; Reach SVHC Compliant: Yes; RoHS Compliant: Yes; ComponentLink1URL: https://datasheet.ciiva.com:443/pdfs/VipMasterIC/IC/CKCI/CKCI-S-A0001796527/CKCI-S-A0001796842-1.pdf?src-supplier=IHS+Markit; ComponentLink1Description: https://datasheet.ciiva.com:443/pdfs/VipMasterIC/IC/CKCI/CKCI-S-A0001796527/CKCI-S-A0001796842-1.pdf?src-supplier=IHS+Markit; ComponentLink2URL: https://datasheet.ciiva.com/29903/getdatasheetpartid-773702-29903807.pdf?src-supplier=Verical; ComponentLink2Description: https://datasheet.ciiva.com/29903/getdatasheetpartid-773702-29903807.pdf?src-supplier=Verical; ComponentLink3URL: https://datasheet.ciiva.com/22637/1707731-22637356.pdf?src-supplier=Element14; ComponentLink3Description: https://datasheet.ciiva.com/22637/1707731-22637356.pdf?src-supplier=Element14; ComponentLink4URL: https://datasheet.ciiva.com/14920/pts645-14920741.pdf?src-supplier=Digikey; ComponentLink4Description: https://datasheet.ciiva.com/14920/pts645-14920741.pdf?src-supplier=Digikey; LCSC Part Number: C221869
U1 = ESP32-S3-MINI-1-N8: SMD module, ESP32-S3FN8, 8 MB SPI flash, PCB antenna; Manufacturer: Espressif Systems; Supplier: Digikey; Supplier Part Number: 1965-ESP32-S3-MINI-1-N8CT-ND; Manufacturer Part Number: ESP32-S3-MINI-1-N8; RoHS: No; Category: LDO; Pricing: 1=5.28, 10=4.566, 25=4.3196, 100=3.9802, 250=3.7768 (USD); ComponentLink1URL: https://datasheet.octopart.com/ESP32-S3-MINI-1-N8-Espressif-Systems-datasheet-165560562.pdf?src-supplier=TME; ComponentLink1Description: https://datasheet.octopart.com/ESP32-S3-MINI-1-N8-Espressif-Systems-datasheet-165560562.pdf?src-supplier=TME; LCSC Part Number: C2913206
U2 = FT231XQ-R: IC USB SERIAL FULL UART 20QFN; Manufacturer: FTDI; Power Supplies: 3.3/5V; Max Supply Current: 8.4mA; Max Supply Voltage: 5.5V; Min Supply Voltage: 2.97V; Nominal Supply Voltage: 5V; Qualification Status: Not Qualified; Supplier: Digikey; Supplier Part Number: 768-1128-1-ND; Manufacturer Part Number: FT231XQ-R; RoHS: Yes; Category: Interface ICs; Stock: 35802; Pricing: 1=2.34, 25=2.27, 100=2.2, 250=2, 500=1.82002, 1000=1.7625 (USD); Case/Package: HVQCCN; Pins: 20; Package Shape: Square; Min Operating Temperature: -40°C; Max Operating Temperature: 85°C; JESD-30 Code: S-XQCC-N20; Package Style: CHIP CARRIER, HEAT SINK/SLUG, VERY THIN PROFILEMeter; Surface Mount: Yes; Technology: CMOS; Terminal Form: No Lead; Terminal Position: QUAD; Length: 4mm; Width: 4mm; Height - Seated (Max): 0.8mm; Terminal Pitch: 0.5mm; Temperature Grade: INDUSTRIAL; Reach SVHC Compliant: Yes; RoHS Compliant: Yes; ComponentLink1URL: https://datasheet.ciiva.com:443/pdfs/VipMasterIC/IC/FTDI/FTDIS00099/FTDIS00099-1.pdf?src-supplier=IHS+Markit; ComponentLink1Description: https://datasheet.ciiva.com:443/pdfs/VipMasterIC/IC/FTDI/FTDIS00099/FTDIS00099-1.pdf?src-supplier=IHS+Markit; ComponentLink2URL: https://datasheet.ciiva.com/1787/ds-ft231x-1787312.pdf?src-supplier=Digikey; ComponentLink2Description: https://datasheet.ciiva.com/1787/ds-ft231x-1787312.pdf?src-supplier=Digikey; ComponentLink3URL: https://datasheet.ciiva.com/30475/0900766b811020d3-30475405.pdf?src-supplier=Rs; ComponentLink3Description: https://datasheet.ciiva.com/30475/0900766b811020d3-30475405.pdf?src-supplier=Rs; ComponentLink4URL: https://datasheet.ciiva.com/4787/ds-ft231x-13571-4787570.pdf?src-supplier=Mouser; ComponentLink4Description: https://datasheet.ciiva.com/4787/ds-ft231x-13571-4787570.pdf?src-supplier=Mouser; ComponentLink5URL: https://datasheet.ciiva.com/1787/ft-x-series-1787313.pdf?src-supplier=Digikey; ComponentLink5Description: https://datasheet.ciiva.com/1787/ft-x-series-1787313.pdf?src-supplier=Digikey; ComponentLink6URL: https://datasheet.ciiva.com/1787/ft-x-series-1787314.pdf?src-supplier=Digikey; ComponentLink6Description: https://datasheet.ciiva.com/1787/ft-x-series-1787314.pdf?src-supplier=Digikey; LCSC Part Number: C132159
U3 = TL1963A-33DCYR: IC REG LIN 3.3V 1.5A SOT-223-4; Manufacturer: Texas Instruments; Package Body Material: Plastic; Adjustability: FIXED; Dropout Voltage1-Max: 550mV; Dropout Voltage1-Nom: 340mV; Input Voltage Absolute-Max: 20V; Min Input Voltage: 3.8V; Channels: 1; Output Voltage1-Max: 3.4V; Output Voltage1-Min: 3.2V; Regulator Type: FIXED POSITIVE SINGLE OUTPUT LDO REGULATOR; Voltage Tolerance-Max: 3%; Qualification Status: Not Qualified; Supplier: Digikey; Supplier Part Number: 296-24897-1-ND; Manufacturer Part Number: TL1963A-33DCYR; RoHS: Yes; Category: Voltage Regulators - Linear; Stock: 2845; Pricing: 1=2.77, 10=2.069, 25=1.8936, 100=1.7, 250=1.60772, 500=1.55212, 1000=1.50634 (USD); Case/Package: SOP; Pins: 4; Package Shape: Rectangular; Terminal Finish: Tin; JESD-609 Code: e3; Max Supply Voltage: 20V; JESD-30 Code: R-PDSO-G4; Moisture Sensitivity Level: 2; Number of Outputs: 1; Operating Temperature, TJ-Max: 125°C; Operating Temperature, TJ-Min: -40°C; Output Current1-Max: 1.5A; Output Voltage1-Nom: 3.3V; Packaging: Tape and Reel; Peak Reflow Temperature (Cel): 260°C; Surface Mount: Yes; Technology: BIPOLAR; Terminal Form: Gull Wing; Terminal Position: DUAL; Length: 6.5mm; Width: 3.5mm; Height - Seated (Max): 1.8mm; Terminal Pitch: 2.3mm; Reach SVHC Compliant: Yes; RoHS Compliant: Yes; ComponentLink1URL: https://www.ti.com:443/lit/ds/symlink/tl1963a.pdf?src-supplier=IHS+Markit; ComponentLink1Description: https://www.ti.com:443/lit/ds/symlink/tl1963a.pdf?src-supplier=IHS+Markit; ComponentLink2URL: https://datasheet.ciiva.com/2046/-2046068.pdf?src-supplier=Digikey; ComponentLink2Description: https://datasheet.ciiva.com/2046/-2046068.pdf?src-supplier=Digikey; LCSC Part Number: C181262